# Altium project MCU_Board.PrjPcb
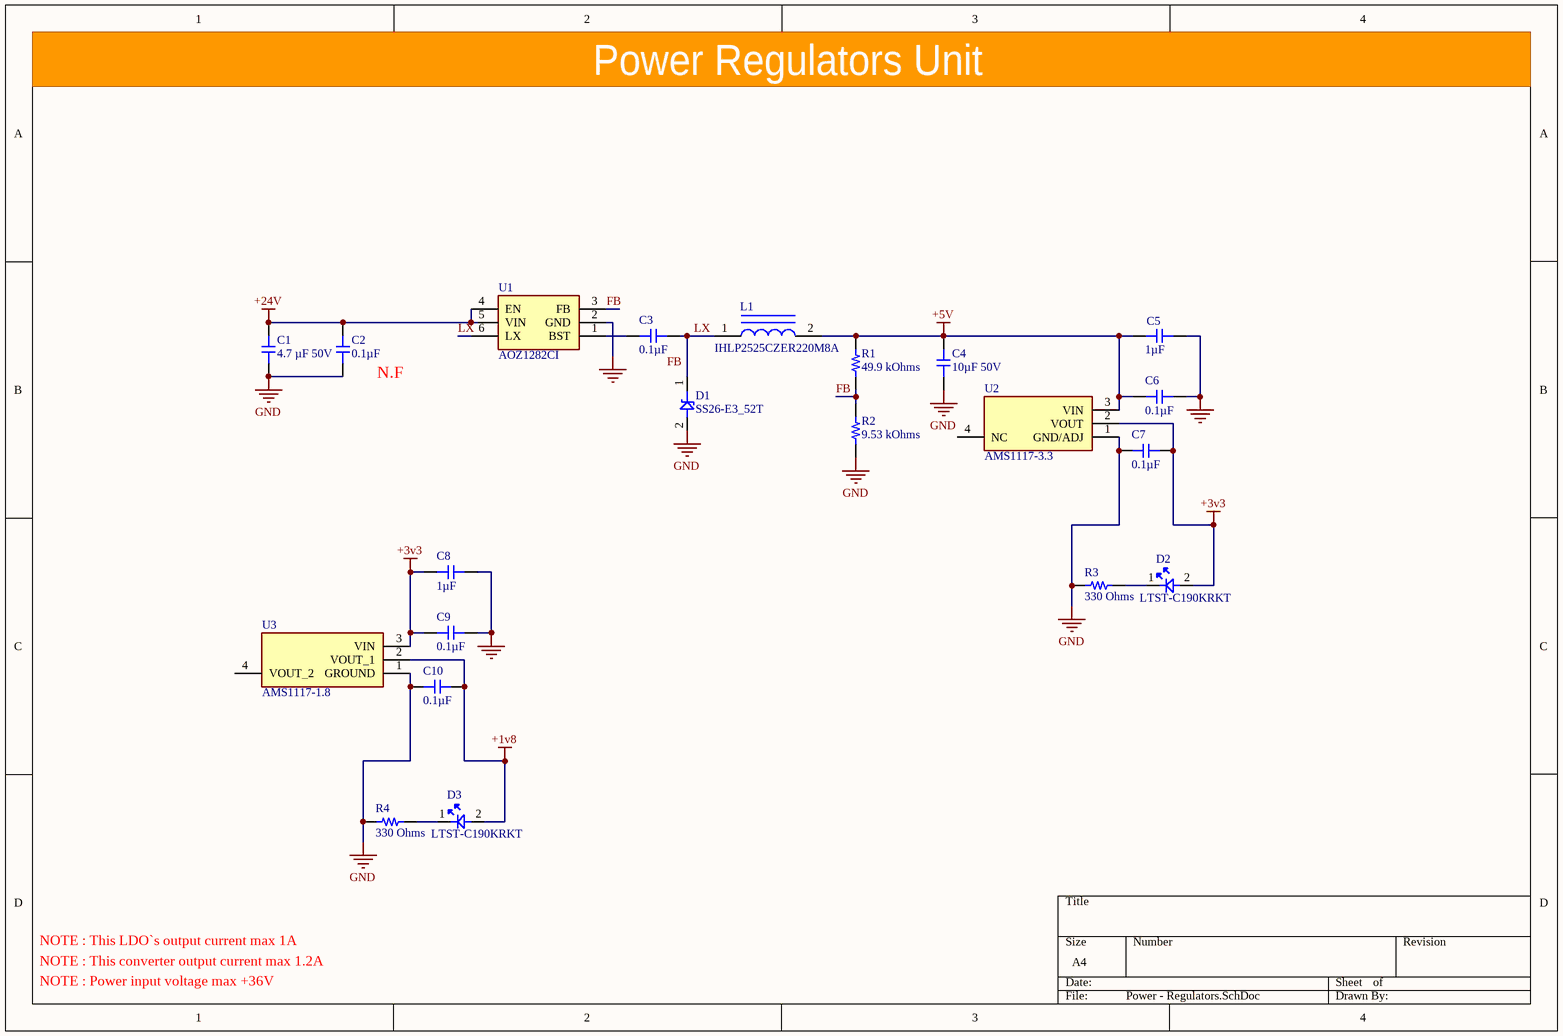
[diagram p0: Power - Regulators.SchDoc]
8 sheets, 132 parts. Net scope: flat (ports and power ports of the same name join across sheets).
Board file: MCUBOARD_V1.PcbDoc
Sheets:
  Power - Regulators.SchDoc
  MCU - STM32F407VGT6.SchDoc
  Ethernet - LAN8720A.SchDoc
  MCU - CAN RS485.SchDoc
  MCU - IMU.SchDoc
  MCU - AUDIO.SchDoc
  MCU - FLASH.SchDoc
  Connector - Carrier.SchDoc

## Sheet Power - Regulators.SchDoc
size A4; SheetNumber: 1; SheetTotal: 8

### Parts
C1  4.7 µF 50V  [1206_10uF]
C2  0.1µF  [0805]
C3  0.1µF  [0805]
C4  10µF 50V  [1206_10uF]
C5  1µF  [0603_Footprint]
C6  0.1µF  [0603_Footprint]
C7  0.1µF  [0603_Footprint]
C8  1µF  [0603_Footprint]
C9  0.1µF  [0603_Footprint]
C10  0.1µF  [0603_Footprint]
D1  SS26-E3_52T  [DIOM5436X244N]
D2  LTST-C190KRKT  [LEDC1608X80N]
D3  LTST-C190KRKT  [LEDC1608X80N]
L1  IHLP2525CZER220M8A  [INDPM6965X300N]
R1  49.9 kOhms  [0603_RES]
R2  9.53 kOhms  [0603_RES]
R3  330 Ohms  [0603_RES]
R4  330 Ohms  [0603_RES]
U1  AOZ1282CI  [SOT95P280X125-6N]
U2  AMS1117-3.3  [SOT229P700X180-4N]
U3  AMS1117-1.8  [SOT229P700X180-4N]

### Nets
+1v8: C10.2 D3.2(A) U3.2(VOUT_1)
+3v3: C7.2 C8.1 C9.1 D2.2(A) U2.2(VOUT) U3.3(VIN)
+5V: C4.1 C5.1 C6.1 L1.2 R1.2 U2.3(VIN)
+24V: C1.1 C2.2 U1.4(EN) U1.5(VIN)
GND: C1.2 C2.1 C4.2 C5.2 C6.2 C7.1 C8.2 C9.2 C10.1 D1.2(A) R2.1 R3.1 R4.1 U1.2(GND) U2.1(GND/ADJ) U3.1(GROUND)
FB: R1.1 R2.2 U1.3(FB)
LX: C3.2 D1.1(K) L1.1 U1.6(LX)
NetC3_1: C3.1 U1.1(BST)
NetD2_1: D2.1(K) R3.2
NetD3_1: D3.1(K) R4.2

Not connected (* = marked no-connect by the designer): U2 4(NC); U3 4(VOUT_2)

### Notes on the sheet
- Power Regulators Unit
- (near C2) N.F
- NOTE : This converter output current max 1.2A
- NOTE : This LDO`s output current max 1A
- NOTE : Power input voltage max +36V
- Labels drawn without touching a wire or pin: FB

### Library data of the parts
C1 = 4.7 uF 50V 1206: 10 uF 50V 1206
C2 C3 = 0.1uF 0805 Surface Capacitor
C4 = 10 uF 50V 1206
C5 C8 = 1uF 0603 Surface Capacitor
C6 C7 C9 C10 = 0.1uF 0603 Surface Capacitor
D1 = SS26-E3_52T: Schottky Diode; Manufacturer_Name: Vishay; Manufacturer_Part_Number: SS26-E3/52T; Datasheet Link: https://componentsearchengine.com/Datasheets/2/SS26-E3_52T.pdf; Height: 2.44mm; Mouser Part Number: 625-SS26-E3; Mouser Price/Stock: https://www.mouser.co.uk/ProductDetail/Vishay-General-Semiconductor/SS26-E3-52T?qs=x2jpVgRnAtNToatHaCRUvw%3D%3D; Arrow Part Number: SS26-E3/52T; Arrow Price/Stock: https://www.arrow.com/en/products/ss26-e352t/vishay?region=europe
D2 D3 = LTST-C190KRKT: LED; Manufacturer_Name: Lite-On; Datasheet Link: https://componentsearchengine.com/Datasheets/1/LTST-C190KRKT.pdf; Height: 0.8mm; Manufacturer_Part_Number: LTST-C190KRKT; Mouser Part Number: 859-LTST-C190KRKT; Mouser Price/Stock: https://www.mouser.co.uk/ProductDetail/Lite-On/LTST-C190KRKT?qs=kAD5fFa1n5VY3YYNWPC1Fg%3D%3D; Arrow Part Number: LTST-C190KRKT; Arrow Price/Stock: https://www.arrow.com/en/products/ltst-c190krkt/lite-on-technology?region=europe
L1 = IHLP2525CZER220M8A: Inductor; Manufacturer_Name: Vishay; Datasheet Link: https://componentsearchengine.com/Datasheets/2/IHLP2525CZER220M8A.pdf; Height: 3mm; Manufacturer_Part_Number: IHLP2525CZER220M8A; Mouser Part Number: 70-IHLP2525CZR220M8A; Mouser Price/Stock: https://www.mouser.co.uk/ProductDetail/Vishay-Dale/IHLP2525CZER220M8A?qs=ei%2FvZTf36ZyKyW60gc1ORQ%3D%3D; Arrow Part Number: IHLP2525CZER220M8A; Arrow Price/Stock: https://www.arrow.com/en/products/ihlp2525czer220m8a/vishay
R1 = 49.9 kOhms 0603
R2 = 9.53 kOhms 0603
R3 R4 = 330 Ohm 0603
U1 = AOZ1282CI: Integrated Circuit; Manufacturer_Name: Alpha & Omega Semiconductors; Datasheet Link: http://www.aosmd.com/res/data_sheets/AOZ1282CI.pdf; Height: 1.25mm; Manufacturer_Part_Number: AOZ1282CI; Arrow Part Number: AOZ1282CI; Arrow Price/Stock: https://www.arrow.com/en/products/aoz1282ci/alpha-and-omega-semiconductor?region=nac
U2 = AMS1117-3.3: Integrated Circuit; Manufacturer_Name: Advanced; Datasheet Link: https://datasheet.datasheetarchive.com/originals/distributors/Datasheets-28/DSA-550594.pdf; Height: 1.8mm; Manufacturer_Part_Number: AMS1117-3.3
U3 = AMS1117-1.8: Integrated Circuit; Manufacturer_Name: Advanced Monolithic Systems; Datasheet Link: https://datasheet.datasheetarchive.com/originals/distributors/Datasheets-1/DSA-6085.pdf; Height: 1.8mm; Manufacturer_Part_Number: AMS1117-1.8

## Sheet MCU - STM32F407VGT6.SchDoc
size A4; SheetNumber: 2; SheetTotal: 8
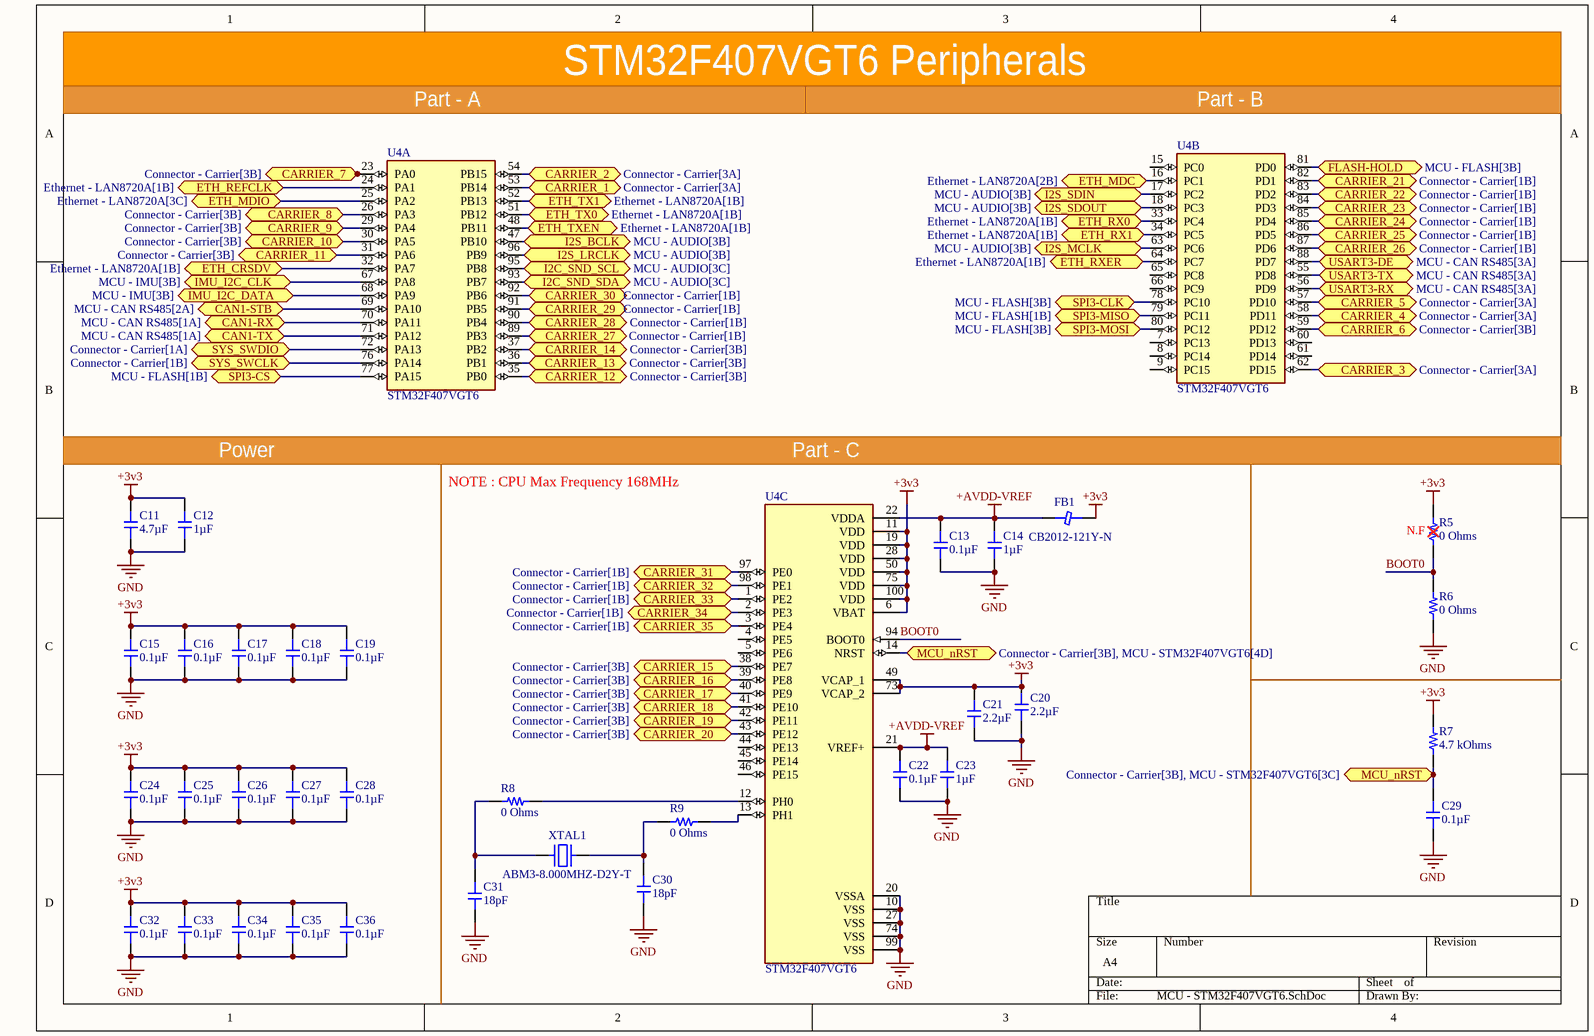
[diagram p1: MCU - STM32F407VGT6.SchDoc]

### Parts
C11  4.7µF  [0603_Footprint]
C12  1µF  [0603_Footprint]
C13  0.1µF  [0603_Footprint]
C14  1µF  [0603_Footprint]
C15  0.1µF  [0603_Footprint]
C16  0.1µF  [0603_Footprint]
C17  0.1µF  [0603_Footprint]
C18  0.1µF  [0603_Footprint]
C19  0.1µF  [0603_Footprint]
C20  2.2µF  [0603_Footprint]
C21  2.2µF  [0603_Footprint]
C22  0.1µF  [0603_Footprint]
C23  1µF  [0603_Footprint]
C24  0.1µF  [0603_Footprint]
C25  0.1µF  [0603_Footprint]
C26  0.1µF  [0603_Footprint]
C27  0.1µF  [0603_Footprint]
C28  0.1µF  [0603_Footprint]
C29  0.1µF  [0603_Footprint]
C30  18pF  [0603_Footprint]
C31  18pF  [0603_Footprint]
C32  0.1µF  [0603_Footprint]
C33  0.1µF  [0603_Footprint]
C34  0.1µF  [0603_Footprint]
C35  0.1µF  [0603_Footprint]
C36  0.1µF  [0603_Footprint]
FB1  CB2012-121Y-N  [Inductor-0603]
R5  0 Ohms  [0603_RES]
R6  0 Ohms  [0603_RES]
R7  4.7 kOhms  [0603_RES]
R8  0 Ohms  [0603_RES]
R9  0 Ohms  [0603_RES]
U4  STM32F407VGT6  [QFP50P1600X1600X160-100N]  (parts A,B,C of 3)
XTAL1  ABM3-8.000MHZ-D2Y-T  [ABM3]

### Ports
CAN1-RX (bidir, see MCU - CAN RS485[1A]), CAN1-STB (bidir, see MCU - CAN RS485[2A]), CAN1-TX (bidir, see MCU - CAN RS485[1A]), CARRIER_1 (bidir, see Connector - Carrier[3A]), CARRIER_2 (bidir, see Connector - Carrier[3A]), CARRIER_3 (bidir, see Connector - Carrier[3A]), CARRIER_4 (bidir, see Connector - Carrier[3A]), CARRIER_5 (bidir, see Connector - Carrier[3A]), CARRIER_6 (bidir, see Connector - Carrier[3B]), CARRIER_7 (bidir, see Connector - Carrier[3B]), CARRIER_8 (bidir, see Connector - Carrier[3B]), CARRIER_9 (bidir, see Connector - Carrier[3B]), CARRIER_10 (bidir, see Connector - Carrier[3B]), CARRIER_11 (bidir, see Connector - Carrier[3B]), CARRIER_12 (bidir, see Connector - Carrier[3B]), CARRIER_13 (bidir, see Connector - Carrier[3B]), CARRIER_14 (bidir, see Connector - Carrier[3B]), CARRIER_15 (bidir, see Connector - Carrier[3B]), CARRIER_16 (bidir, see Connector - Carrier[3B]), CARRIER_17 (bidir, see Connector - Carrier[3B]), CARRIER_18 (bidir, see Connector - Carrier[3B]), CARRIER_19 (bidir, see Connector - Carrier[3B]), CARRIER_20 (bidir, see Connector - Carrier[3B]), CARRIER_21 (bidir, see Connector - Carrier[1B]), CARRIER_22 (bidir, see Connector - Carrier[1B]), CARRIER_23 (bidir, see Connector - Carrier[1B]), CARRIER_24 (bidir, see Connector - Carrier[1B]), CARRIER_25 (bidir, see Connector - Carrier[1B]), CARRIER_26 (bidir, see Connector - Carrier[1B]), CARRIER_27 (bidir, see Connector - Carrier[1B]), CARRIER_28 (bidir, see Connector - Carrier[1B]), CARRIER_29 (bidir, see Connector - Carrier[1B]), CARRIER_30 (bidir, see Connector - Carrier[1B]), CARRIER_31 (bidir, see Connector - Carrier[1B]), CARRIER_32 (bidir, see Connector - Carrier[1B]), CARRIER_33 (bidir, see Connector - Carrier[1B]), CARRIER_34 (bidir, see Connector - Carrier[1B]), CARRIER_35 (bidir, see Connector - Carrier[1B]), ETH_CRSDV (bidir, see Ethernet - LAN8720A[1B]), ETH_MDC (bidir, see Ethernet - LAN8720A[2B]), ETH_MDIO (bidir, see Ethernet - LAN8720A[3C]), ETH_REFCLK (bidir, see Ethernet - LAN8720A[1B]), ETH_RX0 (bidir, see Ethernet - LAN8720A[1B]), ETH_RX1 (bidir, see Ethernet - LAN8720A[1B]), ETH_RXER (bidir, see Ethernet - LAN8720A[1B]), ETH_TX0 (bidir, see Ethernet - LAN8720A[1B]), ETH_TX1 (bidir, see Ethernet - LAN8720A[1B]), ETH_TXEN (bidir, see Ethernet - LAN8720A[1B]), FLASH-HOLD (bidir, see MCU - FLASH[3B]), I2C_SND_SCL (bidir, see MCU - AUDIO[3C]), I2C_SND_SDA (bidir, see MCU - AUDIO[3C]), I2S_BCLK (bidir, see MCU - AUDIO[3B]), I2S_LRCLK (bidir, see MCU - AUDIO[3B]), I2S_MCLK (bidir, see MCU - AUDIO[3B]), I2S_SDIN (bidir, see MCU - AUDIO[3B]), I2S_SDOUT (bidir, see MCU - AUDIO[3B]), IMU_I2C_CLK (bidir, see MCU - IMU[3B]), IMU_I2C_DATA (bidir, see MCU - IMU[3B]), MCU_nRST (bidir, see Connector - Carrier[3B], MCU - STM32F407VGT6[3C]), MCU_nRST (bidir, see Connector - Carrier[3B], MCU - STM32F407VGT6[4D]), SPI3-CLK (bidir, see MCU - FLASH[3B]), SPI3-CS (bidir, see MCU - FLASH[1B]), SPI3-MISO (bidir, see MCU - FLASH[1B]), SPI3-MOSI (bidir, see MCU - FLASH[3B]), SYS_SWCLK (bidir, see Connector - Carrier[1B]), SYS_SWDIO (bidir, see Connector - Carrier[1A]), USART3-DE (bidir, see MCU - CAN RS485[3A]), USART3-RX (bidir, see MCU - CAN RS485[3A]), USART3-TX (bidir, see MCU - CAN RS485[3A])

### Nets
+3v3: C11.1 C12.1 C15.1 C16.1 C17.1 C18.1 C19.1 C20.1 C21.1 C24.1 C25.1 C26.1 C27.1 C28.1 C32.1 C33.1 C34.1 C35.1 C36.1 FB1.2 R5.2 R7.2 U4.6(VBAT) U4.11(VDD) U4.19(VDD) U4.28(VDD) U4.49(VCAP_1) U4.50(VDD) U4.73(VCAP_2) U4.75(VDD) U4.100(VDD)
+AVDD-VREF: C13.1 C14.1 C22.1 C23.1 FB1.1 U4.21(VREF+) U4.22(VDDA)
GND: C11.2 C12.2 C13.2 C14.2 C15.2 C16.2 C17.2 C18.2 C19.2 C20.2 C21.2 C22.2 C23.2 C24.2 C25.2 C26.2 C27.2 C28.2 C29.2 C30.2 C31.2 C32.2 C33.2 C34.2 C35.2 C36.2 R6.1 U4.10(VSS) U4.20(VSSA) U4.27(VSS) U4.74(VSS) U4.99(VSS)
BOOT0: R5.1 R6.2 U4.94(BOOT0)
NetC29_1: C29.1 R7.1 U4.14(NRST) ; port MCU_nRST
NetC30_1: C30.1 R9.1 XTAL1.2
NetC31_1: C31.1 R8.1 XTAL1.1
NetJ5_3: U4.53(PB14) ; port CARRIER_1
NetJ5_5: U4.54(PB15) ; port CARRIER_2
NetJ5_7: U4.62(PD15) ; port CARRIER_3
NetJ5_9: U4.58(PD11) ; port CARRIER_4
NetJ5_11: U4.57(PD10) ; port CARRIER_5
NetJ5_13: U4.59(PD12) ; port CARRIER_6
NetJ5_15: U4.23(PA0) ; port CARRIER_7
NetJ5_19: U4.26(PA3) ; port CARRIER_8
NetJ5_21: U4.29(PA4) ; port CARRIER_9
NetJ5_23: U4.30(PA5) ; port CARRIER_10
NetJ5_25: U4.31(PA6) ; port CARRIER_11
NetJ5_27: U4.35(PB0) ; port CARRIER_12
NetJ5_29: U4.36(PB1) ; port CARRIER_13
NetJ5_31: U4.37(PB2) ; port CARRIER_14
NetJ5_33: U4.38(PE7) ; port CARRIER_15
NetJ5_35: U4.39(PE8) ; port CARRIER_16
NetJ5_37: U4.40(PE9) ; port CARRIER_17
NetJ5_39: U4.41(PE10) ; port CARRIER_18
NetJ5_41: U4.42(PE11) ; port CARRIER_19
NetJ5_43: U4.43(PE12) ; port CARRIER_20
NetJ6_11: U4.72(PA13) ; port SYS_SWDIO
NetJ6_13: U4.76(PA14) ; port SYS_SWCLK
NetJ6_15: U4.82(PD1) ; port CARRIER_21
NetJ6_17: U4.83(PD2) ; port CARRIER_22
NetJ6_19: U4.84(PD3) ; port CARRIER_23
NetJ6_21: U4.85(PD4) ; port CARRIER_24
NetJ6_23: U4.86(PD5) ; port CARRIER_25
NetJ6_25: U4.87(PD6) ; port CARRIER_26
NetJ6_27: U4.89(PB3) ; port CARRIER_27
NetJ6_29: U4.90(PB4) ; port CARRIER_28
NetJ6_31: U4.91(PB5) ; port CARRIER_29
NetJ6_33: U4.92(PB6) ; port CARRIER_30
NetJ6_35: U4.97(PE0) ; port CARRIER_31
NetJ6_37: U4.98(PE1) ; port CARRIER_32
NetJ6_39: U4.1(PE2) ; port CARRIER_33
NetJ6_41: U4.2(PE3) ; port CARRIER_34
NetJ6_43: U4.3(PE4) ; port CARRIER_35
NetR8_2: R8.2 U4.12(PH0)
NetR9_2: R9.2 U4.13(PH1)
NetR14_1: U4.34(PC5) ; port ETH_RX1
NetR15_1: U4.33(PC4) ; port ETH_RX0
NetR16_1: U4.64(PC7) ; port ETH_RXER
NetR18_1: U4.32(PA7) ; port ETH_CRSDV
NetR20_1: U4.24(PA1) ; port ETH_REFCLK
NetR21_2: U4.25(PA2) ; port ETH_MDIO
NetR33_2: U4.67(PA8) ; port IMU_I2C_CLK
NetR34_1: U4.68(PA9) ; port IMU_I2C_DATA
NetR37_2: U4.95(PB8) ; port I2C_SND_SCL
NetR38_2: U4.93(PB7) ; port I2C_SND_SDA
NetR45_2: U4.81(PD0) ; port FLASH-HOLD
NetR46_1: U4.77(PA15) ; port SPI3-CS
NetR47_1: U4.79(PC11) ; port SPI3-MISO
NetR48_2: U4.78(PC10) ; port SPI3-CLK
NetR49_2: U4.80(PC12) ; port SPI3-MOSI
NetU4_16: U4.16(PC1) ; port ETH_MDC
NetU4_17: U4.17(PC2) ; port I2S_SDIN
NetU4_18: U4.18(PC3) ; port I2S_SDOUT
NetU4_47: U4.47(PB10) ; port I2S_BCLK
NetU4_48: U4.48(PB11) ; port ETH_TXEN
NetU4_51: U4.51(PB12) ; port ETH_TX0
NetU4_52: U4.52(PB13) ; port ETH_TX1
NetU4_55: U4.55(PD8) ; port USART3-TX
NetU4_56: U4.56(PD9) ; port USART3-RX
NetU4_63: U4.63(PC6) ; port I2S_MCLK
NetU4_69: U4.69(PA10) ; port CAN1-STB
NetU4_70: U4.70(PA11) ; port CAN1-RX
NetU4_71: U4.71(PA12) ; port CAN1-TX
NetU4_88: U4.88(PD7) ; port USART3-DE
NetU4_96: U4.96(PB9) ; port I2S_LRCLK

Not connected (* = marked no-connect by the designer): U4 4(PE5) 5(PE6) 7(PC13) 8(PC14) 9(PC15) 15(PC0) 44(PE13) 45(PE14) 46(PE15) 60(PD13) 61(PD14) 65(PC8) 66(PC9)

### Notes on the sheet
- Part - A
- STM32F407VGT6 Peripherals
- Part - B
- Power
- NOTE : CPU Max Frequency 168MHz
- Part - C
- (near R5) N.F

### Library data of the parts
C11 = 4.7uF 0603 Surface Capacitor
C12 C14 C23 = 1uF 0603 Surface Capacitor
C13 C15-C19 C22 C24-C29 C32-C36 = 0.1uF 0603 Surface Capacitor
C20 C21 = 2.2uF 0603 Surface Capacitor
C30 C31 = 18pF 0603 Surface Capacitor
R5 R6 R8 R9 = 0 Ohm 0603
R7 = 4.7 kOhms 0603
U4 = STM32F407VGT6: STM32 Series 32-bit 1 MB Flash 192 kB RAM ARM Based Microcontroller - LQFP-100; Price: None; Value: *; MP: STM32F407VGT6; Package: None; Availability: Unavailable
XTAL1 = ABM3-8.000MHZ-D2Y-T: Crystal or Oscillator; Manufacturer_Name: ABRACON; Datasheet Link: https://abracon.com/Resonators/abm3.pdf; Height: 1.3mm; Manufacturer_Part_Number: ABM3-8.000MHZ-D2Y-T; Mouser Part Number: 815-ABM3-8-D2Y-T; Mouser Price/Stock: https://www.mouser.co.uk/ProductDetail/ABRACON/ABM3-8.000MHZ-D2Y-T?qs=ihRgKfnEsN4giUXjc3yS1g%3D%3D; Arrow Part Number: ABM3-8.000MHZ-D2Y-T; Arrow Price/Stock: https://www.arrow.com/en/products/abm3-8.000mhz-d2y-t/abracon?region=europe

## Sheet Ethernet - LAN8720A.SchDoc
size A4; SheetNumber: 3; SheetTotal: 8
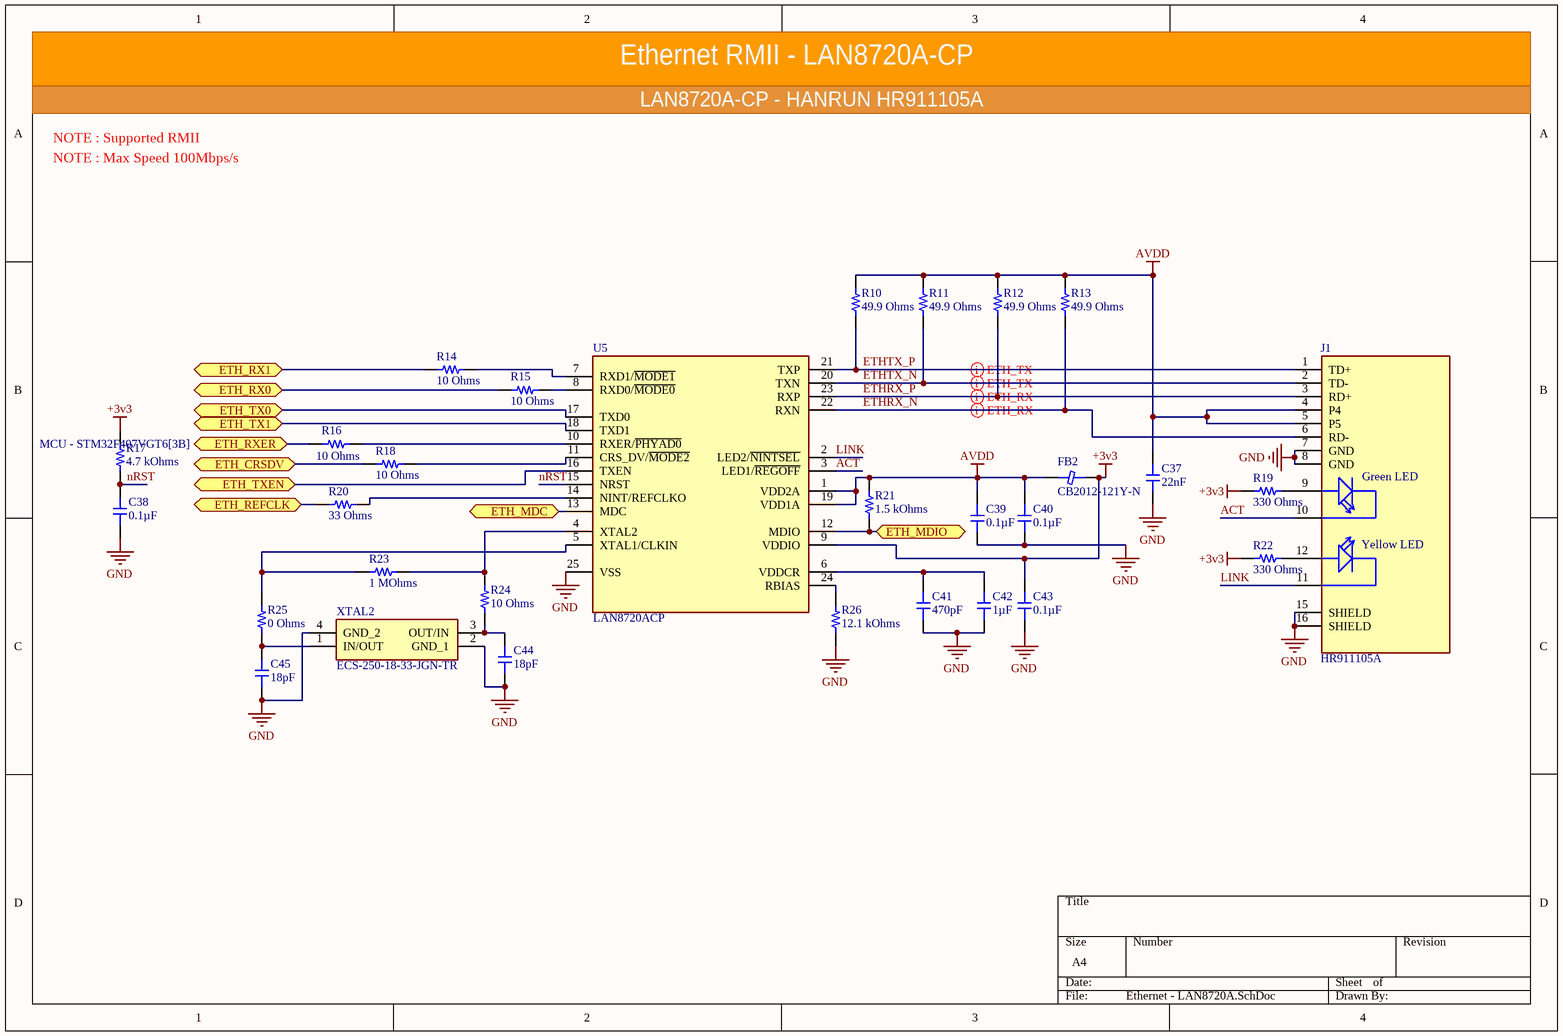
[diagram p2: Ethernet - LAN8720A.SchDoc]

### Parts
C37  22nF  [0603_Footprint]
C38  0.1µF  [0603_Footprint]
C39  0.1µF  [0603_Footprint]
C40  0.1µF  [0603_Footprint]
C41  470pF  [0603_Footprint]
C42  1µF  [0603_Footprint]
C43  0.1µF  [0603_Footprint]
C44  18pF  [0603_Footprint]
C45  18pF  [0603_Footprint]
FB2  CB2012-121Y-N  [Inductor-0603]
J1  HR911105A  [HANRUN_HR911105A]
R10  49.9 Ohms  [0603_RES]
R11  49.9 Ohms  [0603_RES]
R12  49.9 Ohms  [0603_RES]
R13  49.9 Ohms  [0603_RES]
R14  10 Ohms  [0603_RES]
R15  10 Ohms  [0603_RES]
R16  10 Ohms  [0603_RES]
R17  4.7 kOhms  [0603_RES]
R18  10 Ohms  [0603_RES]
R19  330 Ohms  [0603_RES]
R20  33 Ohms  [0603_RES]
R21  1.5 kOhms  [0603_RES]
R22  330 Ohms  [0603_RES]
R23  1 MOhms  [0603_RES]
R24  10 Ohms  [0603_RES]
R25  0 Ohms  [0603_RES]
R26  12.1 kOhms  [0603_RES]
U5  LAN8720ACP  [QFN50P400X400X100-25N-D]
XTAL2  ECS-250-18-33-JGN-TR  [ECS2501833JGNTR]

### Ports
ETH_CRSDV (bidir, see MCU - STM32F407VGT6[1B]), ETH_MDC (bidir, see MCU - STM32F407VGT6[3A]), ETH_MDIO (bidir, see MCU - STM32F407VGT6[1A]), ETH_REFCLK (bidir, see MCU - STM32F407VGT6[1A]), ETH_RX0 (bidir, see MCU - STM32F407VGT6[3A]), ETH_RX1 (bidir, see MCU - STM32F407VGT6[3A]), ETH_RXER (bidir, see MCU - STM32F407VGT6[3B]), ETH_TX0 (bidir, see MCU - STM32F407VGT6[2A]), ETH_TX1 (bidir, see MCU - STM32F407VGT6[2A]), ETH_TXEN (bidir, see MCU - STM32F407VGT6[2A])

### Nets
+3v3: C43.1 FB2.2 R17.2 R19.2 R22.2 U5.9(VDDIO)
AVDD: C37.1 C39.1 C40.1 FB2.1 J1.4(P4) J1.5(P5) R10.2 R11.2 R12.2 R13.2 R21.1 U5.1(VDD2A) U5.19(VDD1A)
GND: C37.2 C38.2 C39.2 C40.2 C41.2 C42.1 C43.2 C44.2 C45.2 J1.7(GND) J1.8(GND) J1.15(SHIELD) J1.16(SHIELD) R26.1 U5.25(VSS) XTAL2.2(GND_1) XTAL2.4(GND_2)
ACT: J1.10(GC) U5.3(LED1/~{REGOFF})
ETHRX_N: J1.6(RD-) R13.1 U5.22(RXN)
ETHRX_P: J1.3(RD+) R12.1 U5.23(RXP)
ETHTX_N: J1.2(TD-) R11.1 U5.20(TXN)
ETHTX_P: J1.1(TD+) R10.1 U5.21(TXP)
LINK: J1.11(YC) U5.2(LED2/~{NINTSEL})
nRST: C38.1 R17.1 U5.15(NRST)
NetC41_1: C41.1 C42.2 U5.6(VDDCR)
NetC44_1: C44.1 R24.2 XTAL2.3(OUT/IN)
NetC45_1: C45.1 R25.1 XTAL2.1(IN/OUT)
NetJ1_9: J1.9(GA) R19.1
NetJ1_12: J1.12(YA) R22.1
NetR14_1: R14.1 ; port ETH_RX1
NetR14_2: R14.2 U5.7(RXD1/~{MODE1})
NetR15_1: R15.1 ; port ETH_RX0
NetR15_2: R15.2 U5.8(RXD0/~{MODE0})
NetR16_1: R16.1 ; port ETH_RXER
NetR16_2: R16.2 U5.10(RXER/~{PHYAD0})
NetR18_1: R18.1 ; port ETH_CRSDV
NetR18_2: R18.2 U5.11(CRS_DV/~{MODE2})
NetR20_1: R20.1 ; port ETH_REFCLK
NetR20_2: R20.2 U5.14(NINT/REFCLKO)
NetR21_2: R21.2 U5.12(MDIO) ; port ETH_MDIO
NetR23_1: R23.1 R25.2 U5.5(XTAL1/CLKIN)
NetR23_2: R23.2 R24.1 U5.4(XTAL2)
NetR26_2: R26.2 U5.24(RBIAS)
NetU4_16: U5.13(MDC) ; port ETH_MDC
NetU4_48: U5.16(TXEN) ; port ETH_TXEN
NetU4_51: U5.17(TXD0) ; port ETH_TX0
NetU4_52: U5.18(TXD1) ; port ETH_TX1

### Layout directives
differential pair; differential pair class ETH_TX: ETHTX_N, ETHTX_P
differential pair; differential pair class ETH_RX: ETHRX_N, ETHRX_P

### Notes on the sheet
- Ethernet RMII - LAN8720A-CP
- LAN8720A-CP - HANRUN HR911105A
- NOTE : Supported RMII
- NOTE : Max Speed 100Mbps/s
- (in symbol HR911105A) Green LED; Yellow LED

### Library data of the parts
C37 = 22nF 0603: 22nF 0603 Surface Capacitor
C38-C40 C43 = 0.1uF 0603 Surface Capacitor_1_1_1_1_1_1: 0.1uF 0603 Surface Capacitor
C41 = 470 pF 0603 Surface Capacitor
C42 = 1uF 0603 Surface Capacitor
C44 C45 = 18pF 0603 Surface Capacitor
J1 = HR911105A: DIP RJ45 Connector;; MF: hanrun; SnapEDA_Link: https://www.snapeda.com/parts/HR911105A/HanRun/view-part/?ref=snap; Package: None; MP: HR911105A; Check_prices: https://www.snapeda.com/parts/HR911105A/HanRun/view-part/?ref=eda; Price: None; Value: *; Availability: Not in stock
R10-R13 = 49.9 Ohms 0603
R14-R16 R18 R24 = 10 Ohm 0603: 10 Ohms 0603
R17 = 4.7 kOhms 0603
R19 R22 = 330 Ohm 0603
R20 = 33 Ohm 0603
R21 = 1.5 kOhms 0603
R23 = 1 MOhms 0603
R25 = 0 Ohm 0603
R26 = 12.1 kOhms 0603
U5 = LAN8720ACP: Ethernet Transreceiver; Manufacturer_Name: Microchip; Datasheet Link: http://ww1.microchip.com/downloads/en/DeviceDoc/8720a.pdf; Height: 1mm; Manufacturer_Part_Number: LAN8720ACP
XTAL2 = ECS-250-18-33-JGN-TR: Crystal or Oscillator; Manufacturer_Name: ECS; Datasheet Link: https://componentsearchengine.com/Datasheets/1/ECS-250-18-33-JGN-TR.pdf; Height: 0.8mm; Manufacturer_Part_Number: ECS-250-18-33-JGN-TR; Mouser Part Number: 520-250-18-33-JGNT; Mouser Price/Stock: https://www.mouser.co.uk/ProductDetail/ECS/ECS-250-18-33-JGN-TR?qs=AQlKX63v8RsjuKdEYMjMow%3D%3D; Arrow Part Number: ECS-250-18-33-JGN-TR; Arrow Price/Stock: https://www.arrow.com/en/products/ecs-250-18-33-jgn-tr/ecs-international?region=nac

## Sheet MCU - CAN RS485.SchDoc
size A4; SheetNumber: 4; SheetTotal: 8
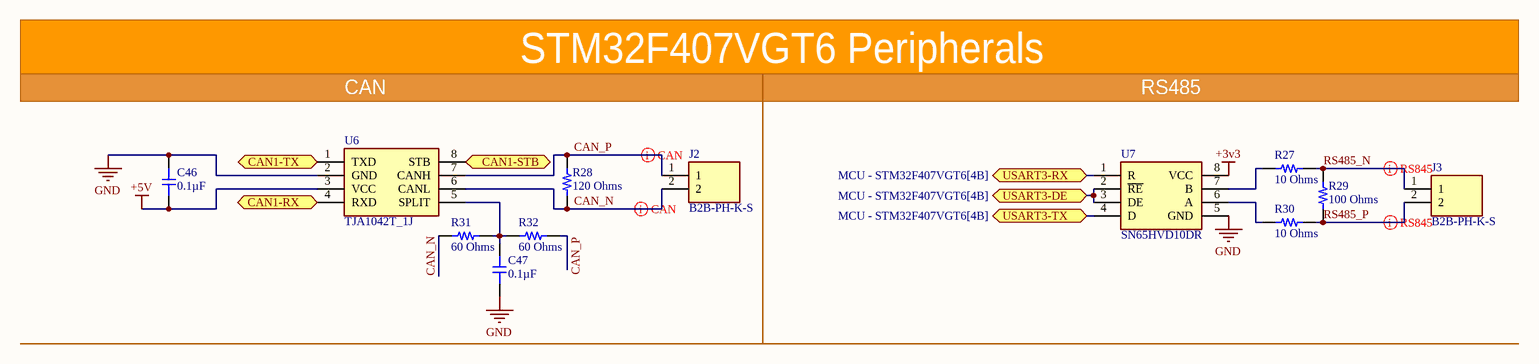
[diagram p3: MCU - CAN RS485.SchDoc]

### Parts
C46  0.1µF  [0603_Footprint]
C47  0.1µF  [0603_Footprint]
J2  B2B-PH-K-S  [JST_B2B-PH-K-S]
J3  B2B-PH-K-S  [JST_B2B-PH-K-S]
R27  10 Ohms  [0603_RES]
R28  120 Ohms  [0603_RES]
R29  100 Ohms  [0603_RES]
R30  10 Ohms  [0603_RES]
R31  60 Ohms  [0603_RES]
R32  60 Ohms  [0603_RES]
U6  TJA1042T_1J  [SOIC127P600X175-8N]
U7  SN65HVD10DR  [SOIC127P600X175-8N]

### Ports
CAN1-RX (bidir, see MCU - STM32F407VGT6[1B]), CAN1-STB (bidir, see MCU - STM32F407VGT6[1B]), CAN1-TX (bidir, see MCU - STM32F407VGT6[1B]), USART3-DE (bidir, see MCU - STM32F407VGT6[4B]), USART3-RX (bidir, see MCU - STM32F407VGT6[4B]), USART3-TX (bidir, see MCU - STM32F407VGT6[4B])

### Nets
+3v3: U7.8(VCC)
+5V: C46.1 U6.3(VCC)
GND: C46.2 C47.2 U6.2(GND) U7.5(GND)
CAN_N: J2.2 R28.1 R31.1 U6.6(CANL)
CAN_P: J2.1 R28.2 R32.2 U6.7(CANH)
RS485_N: J3.1 R27.2 R29.2
RS485_P: J3.2 R29.1 R30.2
NetC47_1: C47.1 R31.2 R32.1 U6.5(SPLIT)
NetR27_1: R27.1 U7.7(B)
NetR30_1: R30.1 U7.6(A)
NetU4_55: U7.4(D) ; port USART3-TX
NetU4_56: U7.1(R) ; port USART3-RX
NetU4_69: U6.8(STB) ; port CAN1-STB
NetU4_70: U6.4(RXD) ; port CAN1-RX
NetU4_71: U6.1(TXD) ; port CAN1-TX
NetU4_88: U7.2(~{RE}) U7.3(DE) ; port USART3-DE

### Layout directives
differential pair; differential pair class RS485: RS485_N, RS485_P
differential pair; differential pair class CAN: CAN_N, CAN_P

### Notes on the sheet
- CAN
- STM32F407VGT6 Peripherals
- RS485

### Library data of the parts
C46 C47 = 0.1uF 0603 Surface Capacitor
J2 J3 = B2B-PH-K-S: Connector Header Through Hole 2 position 0.079 (2.00mm); MF: JST Sales America Inc.; SnapEDA_Link: https://www.snapeda.com/parts/B2B-PH-K-S/JST/view-part/?ref=snap; Package: None; Value: *; MP: B2B-PH-K-S; Check_prices: https://www.snapeda.com/parts/B2B-PH-K-S/JST/view-part/?ref=eda
R27 R30 = 10 Ohm 0603: 10 Ohms 0603
R28 = 120 Ohm 0603
R29 = 100 Ohm 0603
R31 R32 = 60 Ohm 0603
U6 = TJA1042T_1J: Integrated Circuit; Manufacturer_Name: NXP; Manufacturer_Part_Number: TJA1042T/1J; Datasheet Link: http://www.nxp.com/docs/en/data-sheet/TJA1042.pdf; Height: 1.75mm; Mouser Part Number: 771-TJA1042T/1J; Mouser Price/Stock: https://www.mouser.co.uk/ProductDetail/NXP-Semiconductors/TJA1042T-1J?qs=gNSudQoqUYB5nZpx0evBtw%3D%3D; Arrow Part Number: TJA1042T/1J; Arrow Price/Stock: https://www.arrow.com/en/products/tja1042t1j/nxp-semiconductors?region=nac
U7 = SN65HVD10DR: Integrated Circuit; Manufacturer_Name: Texas Instruments; Datasheet Link: http://www.ti.com/lit/gpn/sn65hvd10; Height: 1.75mm; Manufacturer_Part_Number: SN65HVD10DR; Mouser Part Number: 595-SN65HVD10DR; Mouser Price/Stock: https://www.mouser.co.uk/ProductDetail/Texas-Instruments/SN65HVD10DR?qs=QViXGNcIEAviyhAwS0yoXQ%3D%3D; Arrow Part Number: SN65HVD10DR; Arrow Price/Stock: https://www.arrow.com/en/products/sn65hvd10dr/texas-instruments?region=nac

## Sheet MCU - IMU.SchDoc
size A4; SheetNumber: 5; SheetTotal: 8
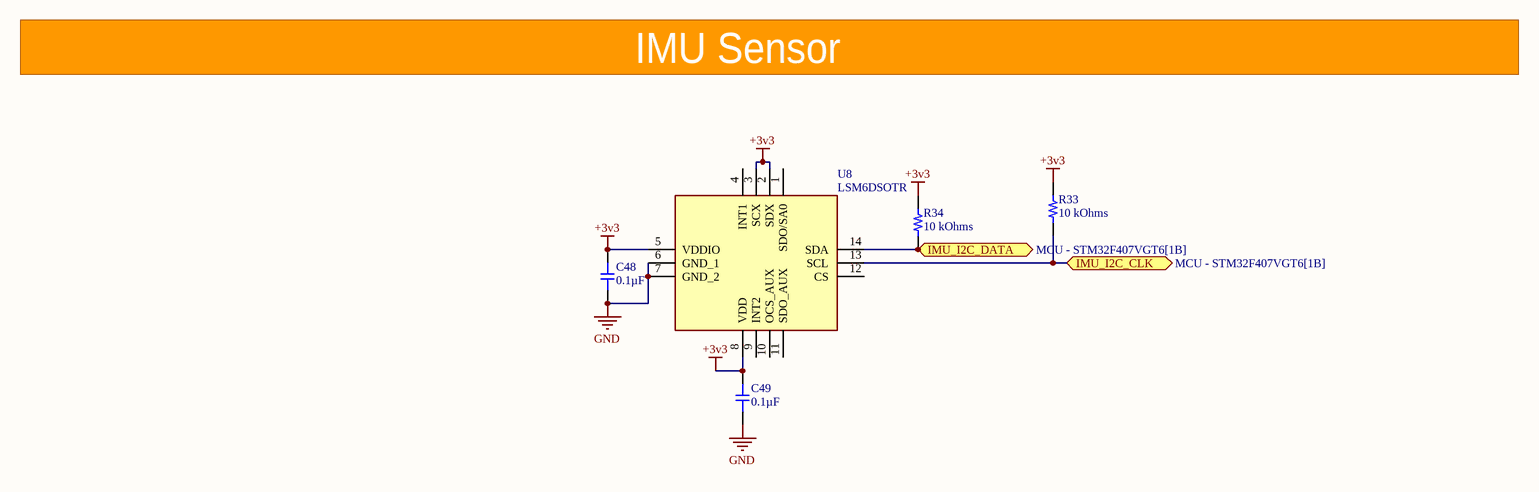
[diagram p4: MCU - IMU.SchDoc]

### Parts
C48  0.1µF  [0603_Footprint]
C49  0.1µF  [0603_Footprint]
R33  10 kOhms  [0603_RES]
R34  10 kOhms  [0603_RES]
U8  LSM6DSOTR  [LGA-14(2.5X3X0.86)]

### Ports
IMU_I2C_CLK (bidir, see MCU - STM32F407VGT6[1B]), IMU_I2C_DATA (bidir, see MCU - STM32F407VGT6[1B])

### Nets
+3v3: C48.1 C49.1 R33.1 R34.2 U8.2(SDX) U8.3(SCX) U8.5(VDDIO) U8.8(VDD)
GND: C48.2 C49.2 U8.6(GND_1) U8.7(GND_2)
NetR33_2: R33.2 U8.13(SCL) ; port IMU_I2C_CLK
NetR34_1: R34.1 U8.14(SDA) ; port IMU_I2C_DATA

Not connected (* = marked no-connect by the designer): U8 1(SDO/SA0) 4(INT1) 9(INT2) 10(OCS_AUX) 11(SDO_AUX) 12(CS)

### Notes on the sheet
- IMU Sensor

### Library data of the parts
C48 C49 = 0.1uF 0603 Surface Capacitor_1_1_1_1_1_1: 0.1uF 0603 Surface Capacitor
R33 R34 = 10 kOhms 0603
U8 = LSM6DSOTR: Accelerometer; Manufacturer_Name: STMicroelectronics; Datasheet Link: https://www.st.com/resource/en/datasheet/lsm6dso.pdf; Manufacturer_Part_Number: LSM6DSOTR; Mouser Part Number: 511-LSM6DSOTR; Mouser Price/Stock: https://www.mouser.co.uk/ProductDetail/STMicroelectronics/LSM6DSOTR?qs=lc2O%252BfHJPVbD197C5c7oNw%3D%3D; Arrow Part Number: LSM6DSOTR; Arrow Price/Stock: https://www.arrow.com/en/products/lsm6dsotr/stmicroelectronics?region=nac

## Sheet MCU - AUDIO.SchDoc
size A4; SheetNumber: 6; SheetTotal: 8
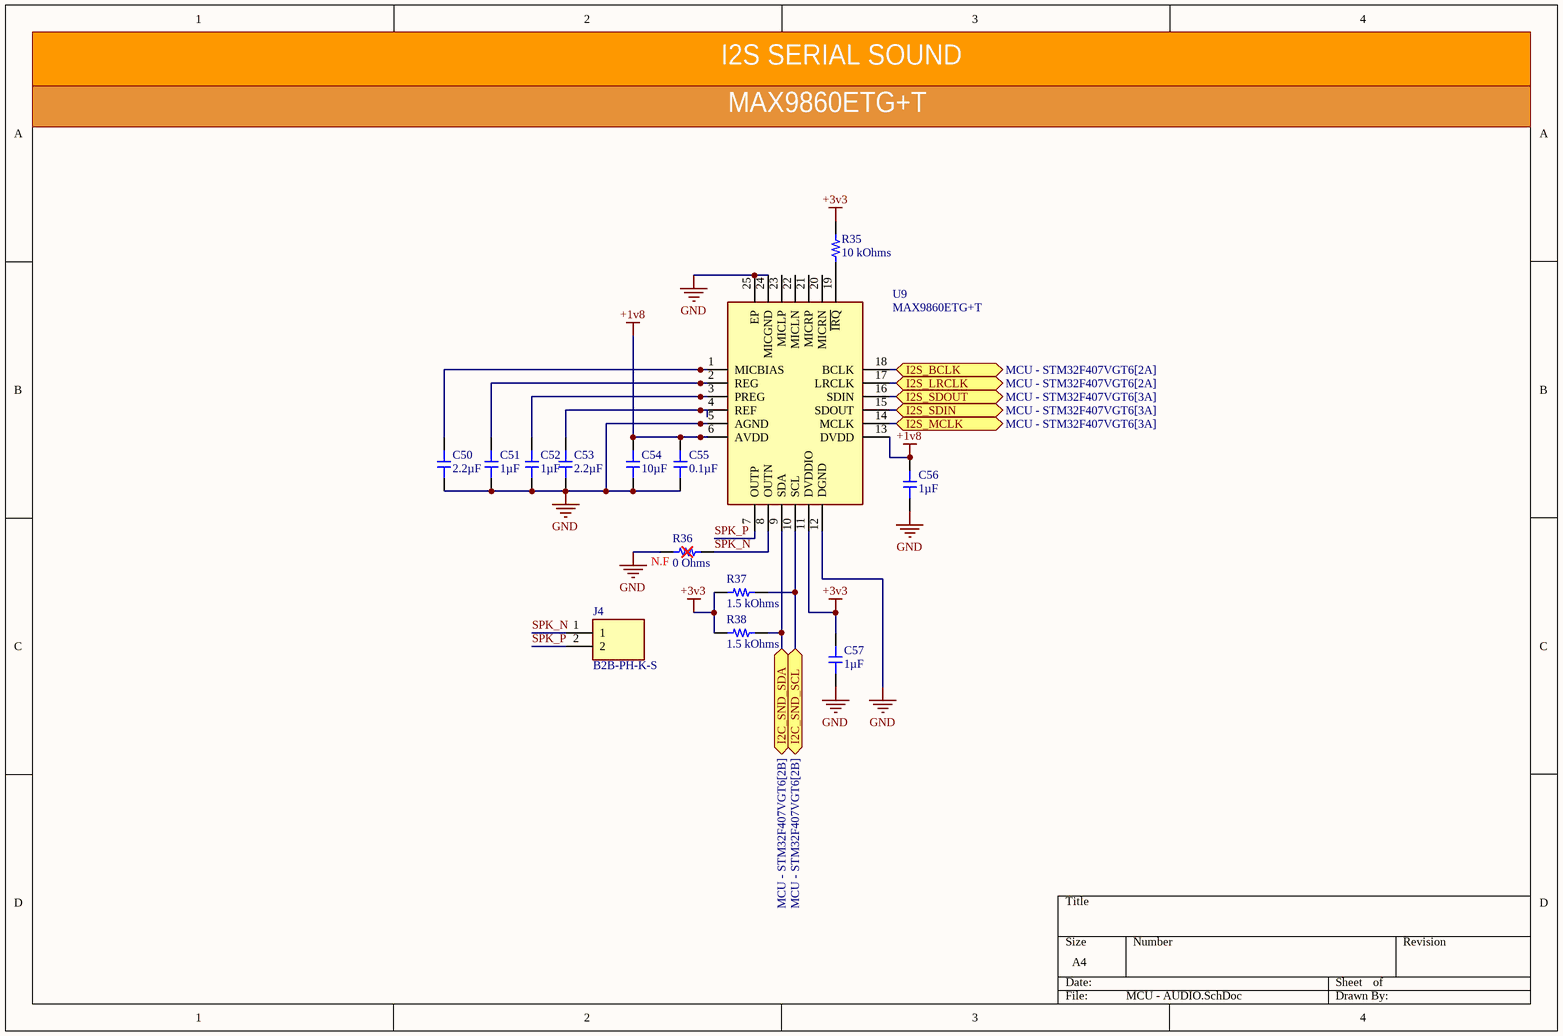
[diagram p5: MCU - AUDIO.SchDoc]

### Parts
C50  2.2µF  [0603_Footprint]
C51  1µF  [0603_Footprint]
C52  1µF  [0603_Footprint]
C53  2.2µF  [0603_Footprint]
C54  10µF  [0805]
C55  0.1µF  [0603_Footprint]
C56  1µF  [0603_Footprint]
C57  1µF  [0603_Footprint]
J4  B2B-PH-K-S  [JST_B2B-PH-K-S]
R35  10 kOhms  [0603_RES]
R36  0 Ohms  [0603_RES]
R37  1.5 kOhms  [0603_RES]
R38  1.5 kOhms  [0603_RES]
U9  MAX9860ETG+T  [QFN50P400X400X80-25N]

### Ports
I2C_SND_SCL (bidir, see MCU - STM32F407VGT6[2B]), I2C_SND_SDA (bidir, see MCU - STM32F407VGT6[2B]), I2S_BCLK (bidir, see MCU - STM32F407VGT6[2A]), I2S_LRCLK (bidir, see MCU - STM32F407VGT6[2A]), I2S_MCLK (bidir, see MCU - STM32F407VGT6[3A]), I2S_SDIN (bidir, see MCU - STM32F407VGT6[3A]), I2S_SDOUT (bidir, see MCU - STM32F407VGT6[3A])

### Nets
+1v8: C54.1 C55.1 C56.1 U9.6(AVDD) U9.13(DVDD)
+3v3: C57.1 R35.2 R37.1 R38.1 U9.11(DVDDIO)
GND: C50.1 C51.2 C52.2 C53.1 C54.2 C55.2 C56.2 C57.2 R36.1 U9.5(AGND) U9.12(DGND) U9.24(MICGND) U9.25(EP)
SPK_N: J4.1 R36.2 U9.8(OUTN)
SPK_P: J4.2 U9.7(OUTP)
NetC50_2: C50.2 U9.1(MICBIAS)
NetC51_1: C51.1 U9.2(REG)
NetC52_1: C52.1 U9.3(PREG)
NetC53_2: C53.2 U9.4(REF)
NetR35_1: R35.1 U9.19(~{IRQ})
NetR37_2: R37.2 U9.10(SCL) ; port I2C_SND_SCL
NetR38_2: R38.2 U9.9(SDA) ; port I2C_SND_SDA
NetU4_17: U9.15(SDOUT) ; port I2S_SDIN
NetU4_18: U9.16(SDIN) ; port I2S_SDOUT
NetU4_47: U9.18(BCLK) ; port I2S_BCLK
NetU4_63: U9.14(MCLK) ; port I2S_MCLK
NetU4_96: U9.17(LRCLK) ; port I2S_LRCLK

Not connected (* = marked no-connect by the designer): U9 20(MICRN) 21(MICRP) 22(MICLN) 23(MICLP)

### Notes on the sheet
- I2S SERIAL SOUND
- MAX9860ETG+T
- (near R36) N.F

### Library data of the parts
C50 C53 = 2.2uF 0603 Surface Capacitor
C51 C52 C56 C57 = 1uF 0603 Surface Capacitor
C54 = 10uF 0805 Surface Capacitor
C55 = 0.1uF 0603 Surface Capacitor_1_1_1_1_1_1: 0.1uF 0603 Surface Capacitor
J4 = B2B-PH-K-S: as J2 on sheet MCU - CAN RS485; SnapEDA_Link: https://www.snapeda.com/parts/B2B-PH-K-S/JST/view-part/?ref=snap; Package: None; Value: *; MP: B2B-PH-K-S; Check_prices: https://www.snapeda.com/parts/B2B-PH-K-S/JST/view-part/?ref=eda
R35 = 10 kOhms 0603
R36 = 0 Ohm 0603
R37 R38 = 1.5 kOhms 0603
U9 = MAX9860ETG+T: Integrated Circuit; Manufacturer_Name: Analog Devices; Datasheet Link: https://datasheets.maximintegrated.com/en/ds/MAX9860.pdf; Height: 0.8mm; Manufacturer_Part_Number: MAX9860ETG+T; Mouser Part Number: 700-MAX9860ETGT; Mouser Price/Stock: https://www.mouser.co.uk/ProductDetail/Analog-Devices-Maxim-Integrated/MAX9860ETG%2bT?qs=LHmEVA8xxfYGy2Ln2j7A4Q%3D%3D; Arrow Part Number: MAX9860ETG+T; Arrow Price/Stock: https://www.arrow.com/en/products/max9860etgt/maxim-integrated?region=nac

## Sheet MCU - FLASH.SchDoc
size A4; SheetNumber: 7; SheetTotal: 8
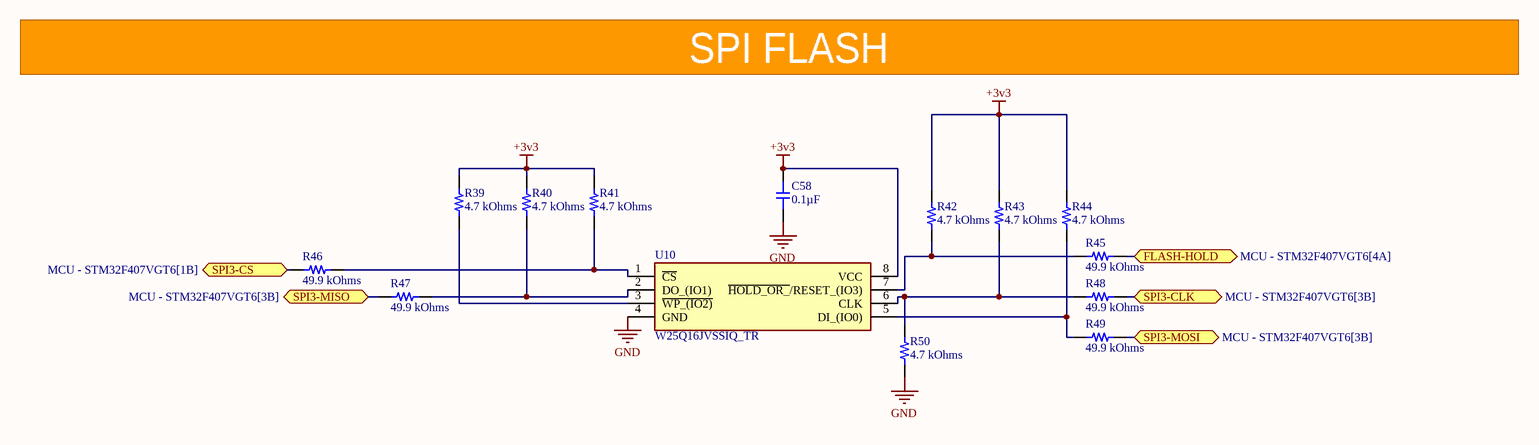
[diagram p6: MCU - FLASH.SchDoc]

### Parts
C58  0.1µF  [0603_Footprint]
R39  4.7 kOhms  [0603_RES]
R40  4.7 kOhms  [0603_RES]
R41  4.7 kOhms  [0603_RES]
R42  4.7 kOhms  [0603_RES]
R43  4.7 kOhms  [0603_RES]
R44  4.7 kOhms  [0603_RES]
R45  49.9 kOhms  [0603_RES]
R46  49.9 kOhms  [0603_RES]
R47  49.9 kOhms  [0603_RES]
R48  49.9 kOhms  [0603_RES]
R49  49.9 kOhms  [0603_RES]
R50  4.7 kOhms  [0603_RES]
U10  W25Q16JVSSIQ_TR  [SOIC127P790X216-8N]

### Ports
FLASH-HOLD (bidir, see MCU - STM32F407VGT6[4A]), SPI3-CLK (bidir, see MCU - STM32F407VGT6[3B]), SPI3-CS (bidir, see MCU - STM32F407VGT6[1B]), SPI3-MISO (bidir, see MCU - STM32F407VGT6[3B]), SPI3-MOSI (bidir, see MCU - STM32F407VGT6[3B])

### Nets
+3v3: C58.1 R39.2 R40.2 R41.2 R42.2 R43.2 R44.2 U10.8(VCC)
GND: C58.2 R50.1 U10.4(GND)
NetR39_1: R39.1 U10.3(~{WP_(IO2)})
NetR40_1: R40.1 R47.2 U10.2(DO_(IO1))
NetR41_1: R41.1 R46.2 U10.1(~{CS})
NetR42_1: R42.1 R45.1 U10.7(~{HOLD_OR_}/RESET_(IO3))
NetR43_1: R43.1 R48.1 R50.2 U10.6(CLK)
NetR44_1: R44.1 R49.1 U10.5(DI_(IO0))
NetR45_2: R45.2 ; port FLASH-HOLD
NetR46_1: R46.1 ; port SPI3-CS
NetR47_1: R47.1 ; port SPI3-MISO
NetR48_2: R48.2 ; port SPI3-CLK
NetR49_2: R49.2 ; port SPI3-MOSI

### Notes on the sheet
- SPI FLASH

### Library data of the parts
C58 = 0.1uF 0603 Surface Capacitor
R39-R44 R50 = 4.7 kOhms 0603
R45-R49 = 49.9 kOhms 0603
U10 = W25Q16JVSSIQ_TR: Integrated Circuit; Manufacturer_Name: Winbond; Manufacturer_Part_Number: W25Q16JVSSIQ TR; Datasheet Link: https://www.winbond.com/resource-files/w25q16jv%20spi%20revg%2003222018%20plus.pdf; Height: 2.16mm; Mouser Part Number: 454-W25Q16JVSSIQTR; Mouser Price/Stock: https://www.mouser.co.uk/ProductDetail/Winbond/W25Q16JVSSIQ-TR?qs=qSfuJ%252Bfl%2Fd6oXlsNm7Svfg%3D%3D; Arrow Part Number: W25Q16JVSSIQ TR; Arrow Price/Stock: https://www.arrow.com/en/products/w25q16jvssiqtr/winbond-electronics?region=nac

## Sheet Connector - Carrier.SchDoc
size A4; SheetNumber: 8; SheetTotal: 8
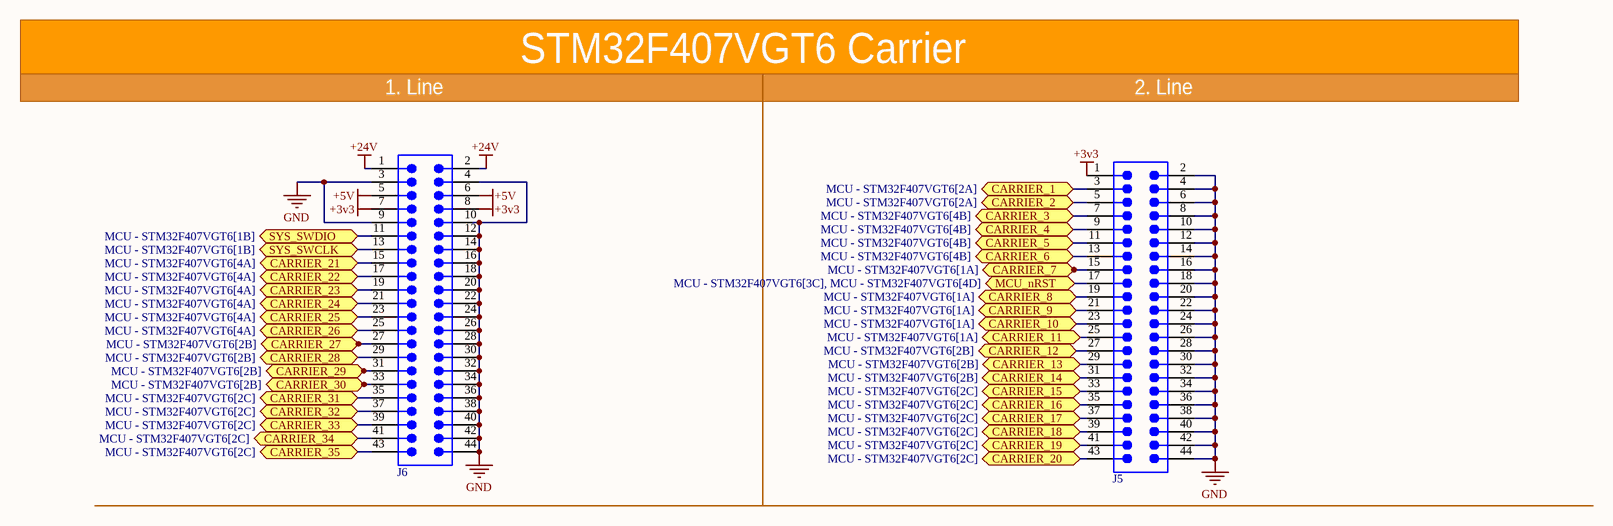
[diagram p7: Connector - Carrier.SchDoc]

### Parts
J5  62004421121  [62004421121]  (value not drawn)
J6  62004421121  [62004421121]  (value not drawn)

### Ports
CARRIER_1 (bidir, see MCU - STM32F407VGT6[2A]), CARRIER_2 (bidir, see MCU - STM32F407VGT6[2A]), CARRIER_3 (bidir, see MCU - STM32F407VGT6[4B]), CARRIER_4 (bidir, see MCU - STM32F407VGT6[4B]), CARRIER_5 (bidir, see MCU - STM32F407VGT6[4B]), CARRIER_6 (bidir, see MCU - STM32F407VGT6[4B]), CARRIER_7 (bidir, see MCU - STM32F407VGT6[1A]), CARRIER_8 (bidir, see MCU - STM32F407VGT6[1A]), CARRIER_9 (bidir, see MCU - STM32F407VGT6[1A]), CARRIER_10 (bidir, see MCU - STM32F407VGT6[1A]), CARRIER_11 (bidir, see MCU - STM32F407VGT6[1A]), CARRIER_12 (bidir, see MCU - STM32F407VGT6[2B]), CARRIER_13 (bidir, see MCU - STM32F407VGT6[2B]), CARRIER_14 (bidir, see MCU - STM32F407VGT6[2B]), CARRIER_15 (bidir, see MCU - STM32F407VGT6[2C]), CARRIER_16 (bidir, see MCU - STM32F407VGT6[2C]), CARRIER_17 (bidir, see MCU - STM32F407VGT6[2C]), CARRIER_18 (bidir, see MCU - STM32F407VGT6[2C]), CARRIER_19 (bidir, see MCU - STM32F407VGT6[2C]), CARRIER_20 (bidir, see MCU - STM32F407VGT6[2C]), CARRIER_21 (bidir, see MCU - STM32F407VGT6[4A]), CARRIER_22 (bidir, see MCU - STM32F407VGT6[4A]), CARRIER_23 (bidir, see MCU - STM32F407VGT6[4A]), CARRIER_24 (bidir, see MCU - STM32F407VGT6[4A]), CARRIER_25 (bidir, see MCU - STM32F407VGT6[4A]), CARRIER_26 (bidir, see MCU - STM32F407VGT6[4A]), CARRIER_27 (bidir, see MCU - STM32F407VGT6[2B]), CARRIER_28 (bidir, see MCU - STM32F407VGT6[2B]), CARRIER_29 (bidir, see MCU - STM32F407VGT6[2B]), CARRIER_30 (bidir, see MCU - STM32F407VGT6[2B]), CARRIER_31 (bidir, see MCU - STM32F407VGT6[2C]), CARRIER_32 (bidir, see MCU - STM32F407VGT6[2C]), CARRIER_33 (bidir, see MCU - STM32F407VGT6[2C]), CARRIER_34 (bidir, see MCU - STM32F407VGT6[2C]), CARRIER_35 (bidir, see MCU - STM32F407VGT6[2C]), MCU_nRST (bidir, see MCU - STM32F407VGT6[3C], MCU - STM32F407VGT6[4D]), SYS_SWCLK (bidir, see MCU - STM32F407VGT6[1B]), SYS_SWDIO (bidir, see MCU - STM32F407VGT6[1B])

### Nets
+3v3: J5.1 J6.7 J6.8
+5V: J6.5 J6.6
+24V: J6.1 J6.2
GND: J5.2 J5.4 J5.6 J5.8 J5.10 J5.12 J5.14 J5.16 J5.18 J5.20 J5.22 J5.24 J5.26 J5.28 J5.30 J5.32 J5.34 J5.36 J5.38 J5.40 J5.42 J5.44 J6.3 J6.4 J6.9 J6.10 J6.12 J6.14 J6.16 J6.18 J6.20 J6.22 J6.24 J6.26 J6.28 J6.30 J6.32 J6.34 J6.36 J6.38 J6.40 J6.42 J6.44
NetC29_1: J5.17 ; port MCU_nRST
NetJ5_3: J5.3 ; port CARRIER_1
NetJ5_5: J5.5 ; port CARRIER_2
NetJ5_7: J5.7 ; port CARRIER_3
NetJ5_9: J5.9 ; port CARRIER_4
NetJ5_11: J5.11 ; port CARRIER_5
NetJ5_13: J5.13 ; port CARRIER_6
NetJ5_15: J5.15 ; port CARRIER_7
NetJ5_19: J5.19 ; port CARRIER_8
NetJ5_21: J5.21 ; port CARRIER_9
NetJ5_23: J5.23 ; port CARRIER_10
NetJ5_25: J5.25 ; port CARRIER_11
NetJ5_27: J5.27 ; port CARRIER_12
NetJ5_29: J5.29 ; port CARRIER_13
NetJ5_31: J5.31 ; port CARRIER_14
NetJ5_33: J5.33 ; port CARRIER_15
NetJ5_35: J5.35 ; port CARRIER_16
NetJ5_37: J5.37 ; port CARRIER_17
NetJ5_39: J5.39 ; port CARRIER_18
NetJ5_41: J5.41 ; port CARRIER_19
NetJ5_43: J5.43 ; port CARRIER_20
NetJ6_11: J6.11 ; port SYS_SWDIO
NetJ6_13: J6.13 ; port SYS_SWCLK
NetJ6_15: J6.15 ; port CARRIER_21
NetJ6_17: J6.17 ; port CARRIER_22
NetJ6_19: J6.19 ; port CARRIER_23
NetJ6_21: J6.21 ; port CARRIER_24
NetJ6_23: J6.23 ; port CARRIER_25
NetJ6_25: J6.25 ; port CARRIER_26
NetJ6_27: J6.27 ; port CARRIER_27
NetJ6_29: J6.29 ; port CARRIER_28
NetJ6_31: J6.31 ; port CARRIER_29
NetJ6_33: J6.33 ; port CARRIER_30
NetJ6_35: J6.35 ; port CARRIER_31
NetJ6_37: J6.37 ; port CARRIER_32
NetJ6_39: J6.39 ; port CARRIER_33
NetJ6_41: J6.41 ; port CARRIER_34
NetJ6_43: J6.43 ; port CARRIER_35

### Notes on the sheet
- 1. Line
- STM32F407VGT6 Carrier
- 2. Line

### Library data of the parts
J5 J6 = 62004421121: WR-PHD Pin Header, THT, Vertical, pitch 2mm, 2 Row, 44P; Manufacturer: Wurth Elektronik; Contact Resistance: 20mOhm; Rated Current: 2A; Working Voltage: 200V; Withstanding Voltage: 500V; Manufacturer Part Number: 62004421121; Category: Board-to-Board Connectors; Match Code: WR-PHD; ComponentLink1Description: Website Link; ComponentLink1URL: https://www.we-online.com/redexpert/article/62004421121?ad; ComponentLink2Description: Datasheet Link; ComponentLink2URL: https://www.we-online.com/redexpert/spec/62004421121?ad; Mount: Through Hole; Operating Temperature Max: 105°C; Operating Temperature Min: -40°C; Packaging: Bag; Gender: Pin Header; Number of Pins: 44; Number of Rows: 2; Orientation: Vertical; Pitch: 2mm

## Nets that join several sheets
+1v8: Power - Regulators (C10.2 D3.2 U3.2), MCU - AUDIO (5 pins)
+3v3: Power - Regulators (6 pins), MCU - STM32F407VGT6 (31 pins), Ethernet - LAN8720A (6 pins), MCU - CAN RS485 (U7.8), MCU - IMU (8 pins), MCU - AUDIO (5 pins), MCU - FLASH (8 pins), Connector - Carrier (J5.1 J6.7 J6.8)
+5V: Power - Regulators (6 pins), MCU - CAN RS485 (C46.1 U6.3), Connector - Carrier (J6.5 J6.6)
+24V: Power - Regulators (C1.1 C2.2 U1.4 U1.5), Connector - Carrier (J6.1 J6.2)
GND: Power - Regulators (16 pins), MCU - STM32F407VGT6 (32 pins), Ethernet - LAN8720A (17 pins), MCU - CAN RS485 (C46.2 C47.2 U6.2 U7.5), MCU - IMU (C48.2 C49.2 U8.6 U8.7), MCU - AUDIO (13 pins), MCU - FLASH (C58.2 R50.1 U10.4), Connector - Carrier (43 pins)
NetC29_1: MCU - STM32F407VGT6 (C29.1 R7.1 U4.14), Connector - Carrier (J5.17)
NetJ5_3: MCU - STM32F407VGT6 (U4.53), Connector - Carrier (J5.3)
NetJ5_5: MCU - STM32F407VGT6 (U4.54), Connector - Carrier (J5.5)
NetJ5_7: MCU - STM32F407VGT6 (U4.62), Connector - Carrier (J5.7)
NetJ5_9: MCU - STM32F407VGT6 (U4.58), Connector - Carrier (J5.9)
NetJ5_11: MCU - STM32F407VGT6 (U4.57), Connector - Carrier (J5.11)
NetJ5_13: MCU - STM32F407VGT6 (U4.59), Connector - Carrier (J5.13)
NetJ5_15: MCU - STM32F407VGT6 (U4.23), Connector - Carrier (J5.15)
NetJ5_19: MCU - STM32F407VGT6 (U4.26), Connector - Carrier (J5.19)
NetJ5_21: MCU - STM32F407VGT6 (U4.29), Connector - Carrier (J5.21)
NetJ5_23: MCU - STM32F407VGT6 (U4.30), Connector - Carrier (J5.23)
NetJ5_25: MCU - STM32F407VGT6 (U4.31), Connector - Carrier (J5.25)
NetJ5_27: MCU - STM32F407VGT6 (U4.35), Connector - Carrier (J5.27)
NetJ5_29: MCU - STM32F407VGT6 (U4.36), Connector - Carrier (J5.29)
NetJ5_31: MCU - STM32F407VGT6 (U4.37), Connector - Carrier (J5.31)
NetJ5_33: MCU - STM32F407VGT6 (U4.38), Connector - Carrier (J5.33)
NetJ5_35: MCU - STM32F407VGT6 (U4.39), Connector - Carrier (J5.35)
NetJ5_37: MCU - STM32F407VGT6 (U4.40), Connector - Carrier (J5.37)
NetJ5_39: MCU - STM32F407VGT6 (U4.41), Connector - Carrier (J5.39)
NetJ5_41: MCU - STM32F407VGT6 (U4.42), Connector - Carrier (J5.41)
NetJ5_43: MCU - STM32F407VGT6 (U4.43), Connector - Carrier (J5.43)
NetJ6_11: MCU - STM32F407VGT6 (U4.72), Connector - Carrier (J6.11)
NetJ6_13: MCU - STM32F407VGT6 (U4.76), Connector - Carrier (J6.13)
NetJ6_15: MCU - STM32F407VGT6 (U4.82), Connector - Carrier (J6.15)
NetJ6_17: MCU - STM32F407VGT6 (U4.83), Connector - Carrier (J6.17)
NetJ6_19: MCU - STM32F407VGT6 (U4.84), Connector - Carrier (J6.19)
NetJ6_21: MCU - STM32F407VGT6 (U4.85), Connector - Carrier (J6.21)
NetJ6_23: MCU - STM32F407VGT6 (U4.86), Connector - Carrier (J6.23)
NetJ6_25: MCU - STM32F407VGT6 (U4.87), Connector - Carrier (J6.25)
NetJ6_27: MCU - STM32F407VGT6 (U4.89), Connector - Carrier (J6.27)
NetJ6_29: MCU - STM32F407VGT6 (U4.90), Connector - Carrier (J6.29)
NetJ6_31: MCU - STM32F407VGT6 (U4.91), Connector - Carrier (J6.31)
NetJ6_33: MCU - STM32F407VGT6 (U4.92), Connector - Carrier (J6.33)
NetJ6_35: MCU - STM32F407VGT6 (U4.97), Connector - Carrier (J6.35)
NetJ6_37: MCU - STM32F407VGT6 (U4.98), Connector - Carrier (J6.37)
NetJ6_39: MCU - STM32F407VGT6 (U4.1), Connector - Carrier (J6.39)
NetJ6_41: MCU - STM32F407VGT6 (U4.2), Connector - Carrier (J6.41)
NetJ6_43: MCU - STM32F407VGT6 (U4.3), Connector - Carrier (J6.43)
NetR14_1: MCU - STM32F407VGT6 (U4.34), Ethernet - LAN8720A (R14.1)
NetR15_1: MCU - STM32F407VGT6 (U4.33), Ethernet - LAN8720A (R15.1)
NetR16_1: MCU - STM32F407VGT6 (U4.64), Ethernet - LAN8720A (R16.1)
NetR18_1: MCU - STM32F407VGT6 (U4.32), Ethernet - LAN8720A (R18.1)
NetR20_1: MCU - STM32F407VGT6 (U4.24), Ethernet - LAN8720A (R20.1)
NetR21_2: MCU - STM32F407VGT6 (U4.25), Ethernet - LAN8720A (R21.2 U5.12)
NetR33_2: MCU - STM32F407VGT6 (U4.67), MCU - IMU (R33.2 U8.13)
NetR34_1: MCU - STM32F407VGT6 (U4.68), MCU - IMU (R34.1 U8.14)
NetR37_2: MCU - STM32F407VGT6 (U4.95), MCU - AUDIO (R37.2 U9.10)
NetR38_2: MCU - STM32F407VGT6 (U4.93), MCU - AUDIO (R38.2 U9.9)
NetR45_2: MCU - STM32F407VGT6 (U4.81), MCU - FLASH (R45.2)
NetR46_1: MCU - STM32F407VGT6 (U4.77), MCU - FLASH (R46.1)
NetR47_1: MCU - STM32F407VGT6 (U4.79), MCU - FLASH (R47.1)
NetR48_2: MCU - STM32F407VGT6 (U4.78), MCU - FLASH (R48.2)
NetR49_2: MCU - STM32F407VGT6 (U4.80), MCU - FLASH (R49.2)
NetU4_16: MCU - STM32F407VGT6 (U4.16), Ethernet - LAN8720A (U5.13)
NetU4_17: MCU - STM32F407VGT6 (U4.17), MCU - AUDIO (U9.15)
NetU4_18: MCU - STM32F407VGT6 (U4.18), MCU - AUDIO (U9.16)
NetU4_47: MCU - STM32F407VGT6 (U4.47), MCU - AUDIO (U9.18)
NetU4_48: MCU - STM32F407VGT6 (U4.48), Ethernet - LAN8720A (U5.16)
NetU4_51: MCU - STM32F407VGT6 (U4.51), Ethernet - LAN8720A (U5.17)
NetU4_52: MCU - STM32F407VGT6 (U4.52), Ethernet - LAN8720A (U5.18)
NetU4_55: MCU - STM32F407VGT6 (U4.55), MCU - CAN RS485 (U7.4)
NetU4_56: MCU - STM32F407VGT6 (U4.56), MCU - CAN RS485 (U7.1)
NetU4_63: MCU - STM32F407VGT6 (U4.63), MCU - AUDIO (U9.14)
NetU4_69: MCU - STM32F407VGT6 (U4.69), MCU - CAN RS485 (U6.8)
NetU4_70: MCU - STM32F407VGT6 (U4.70), MCU - CAN RS485 (U6.4)
NetU4_71: MCU - STM32F407VGT6 (U4.71), MCU - CAN RS485 (U6.1)
NetU4_88: MCU - STM32F407VGT6 (U4.88), MCU - CAN RS485 (U7.2 U7.3)
NetU4_96: MCU - STM32F407VGT6 (U4.96), MCU - AUDIO (U9.17)